# Altium schematic sheet MC34063.SchDoc
size A4
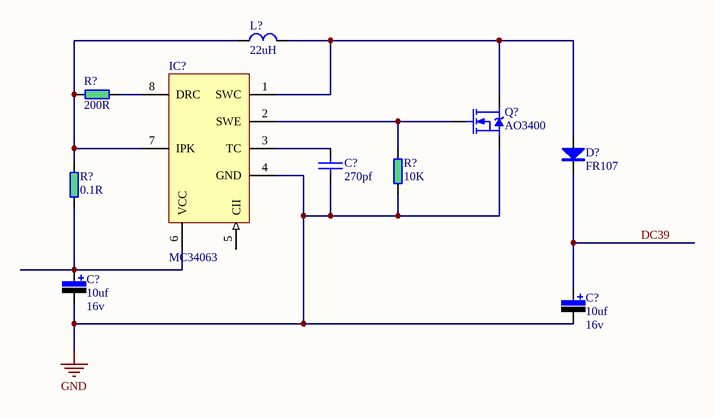
[diagram p0: MC34063.SchDoc]

## Parts
(Parts that share a designator on the sheet are numbered #1, #2 ... from top to bottom, then left to right.)
C?#1  value 270pf  [C 0603]  (hidden comment: 04.Cap)
C?#2  value 10uf  value 16v  [CAP 16v330uf（6*8）]  (hidden comment: 05.Cap-EC)
C?#3  value 10uf  value 16v  [CAP 63V100uf（8*11）]  (hidden comment: 05.Cap-EC)
D?  FR107  [D FR107-SOD123]
IC?  MC34063  [SOP8]
L?  22uH  [L CD75]
Q?  AO3400  [FET-M3004D-TO252]
R?#1  200R  [R 0603]
R?#2  10K  [R 0603]
R?#3  0.1R  [R 1210]

## Nets
GND: C?#1.2 C?#2.2 C?#3.2 IC?.4(GND) Q?.S R?#2.1
DC39: C?#3.1 D?.K
NetC?#1_1: C?#1.1 IC?.3(TC)
NetC?#2_1: C?#2.1 IC?.6(VCC) R?#3.1
NetD?_A: D?.A IC?.1(SWC) L?.2 Q?.D
NetIC?_2: IC?.2(SWE) Q?.G R?#2.2
NetIC?_7: IC?.7(IPK) L?.1 R?#1.1 R?#3.2
NetIC?_8: IC?.8(DRC) R?#1.2

Not connected (* = marked no-connect by the designer): IC? 5(CII)

## Library data of the parts
C?#1 = 04.Cap: 电容
C?#2 C?#3 = 05.Cap-EC: 电解电容
D? = 12.Diode: 二极管
IC? = MC34063: DC-DC 转换器控制电路
L? = 06.Ind: 电感
Q? = 09.FET(N): MOS管 NPN
R?#1-R?#3 = 01.Res: 电阻